# EAGLE design 0x02 (EAGLE 7.1.0)
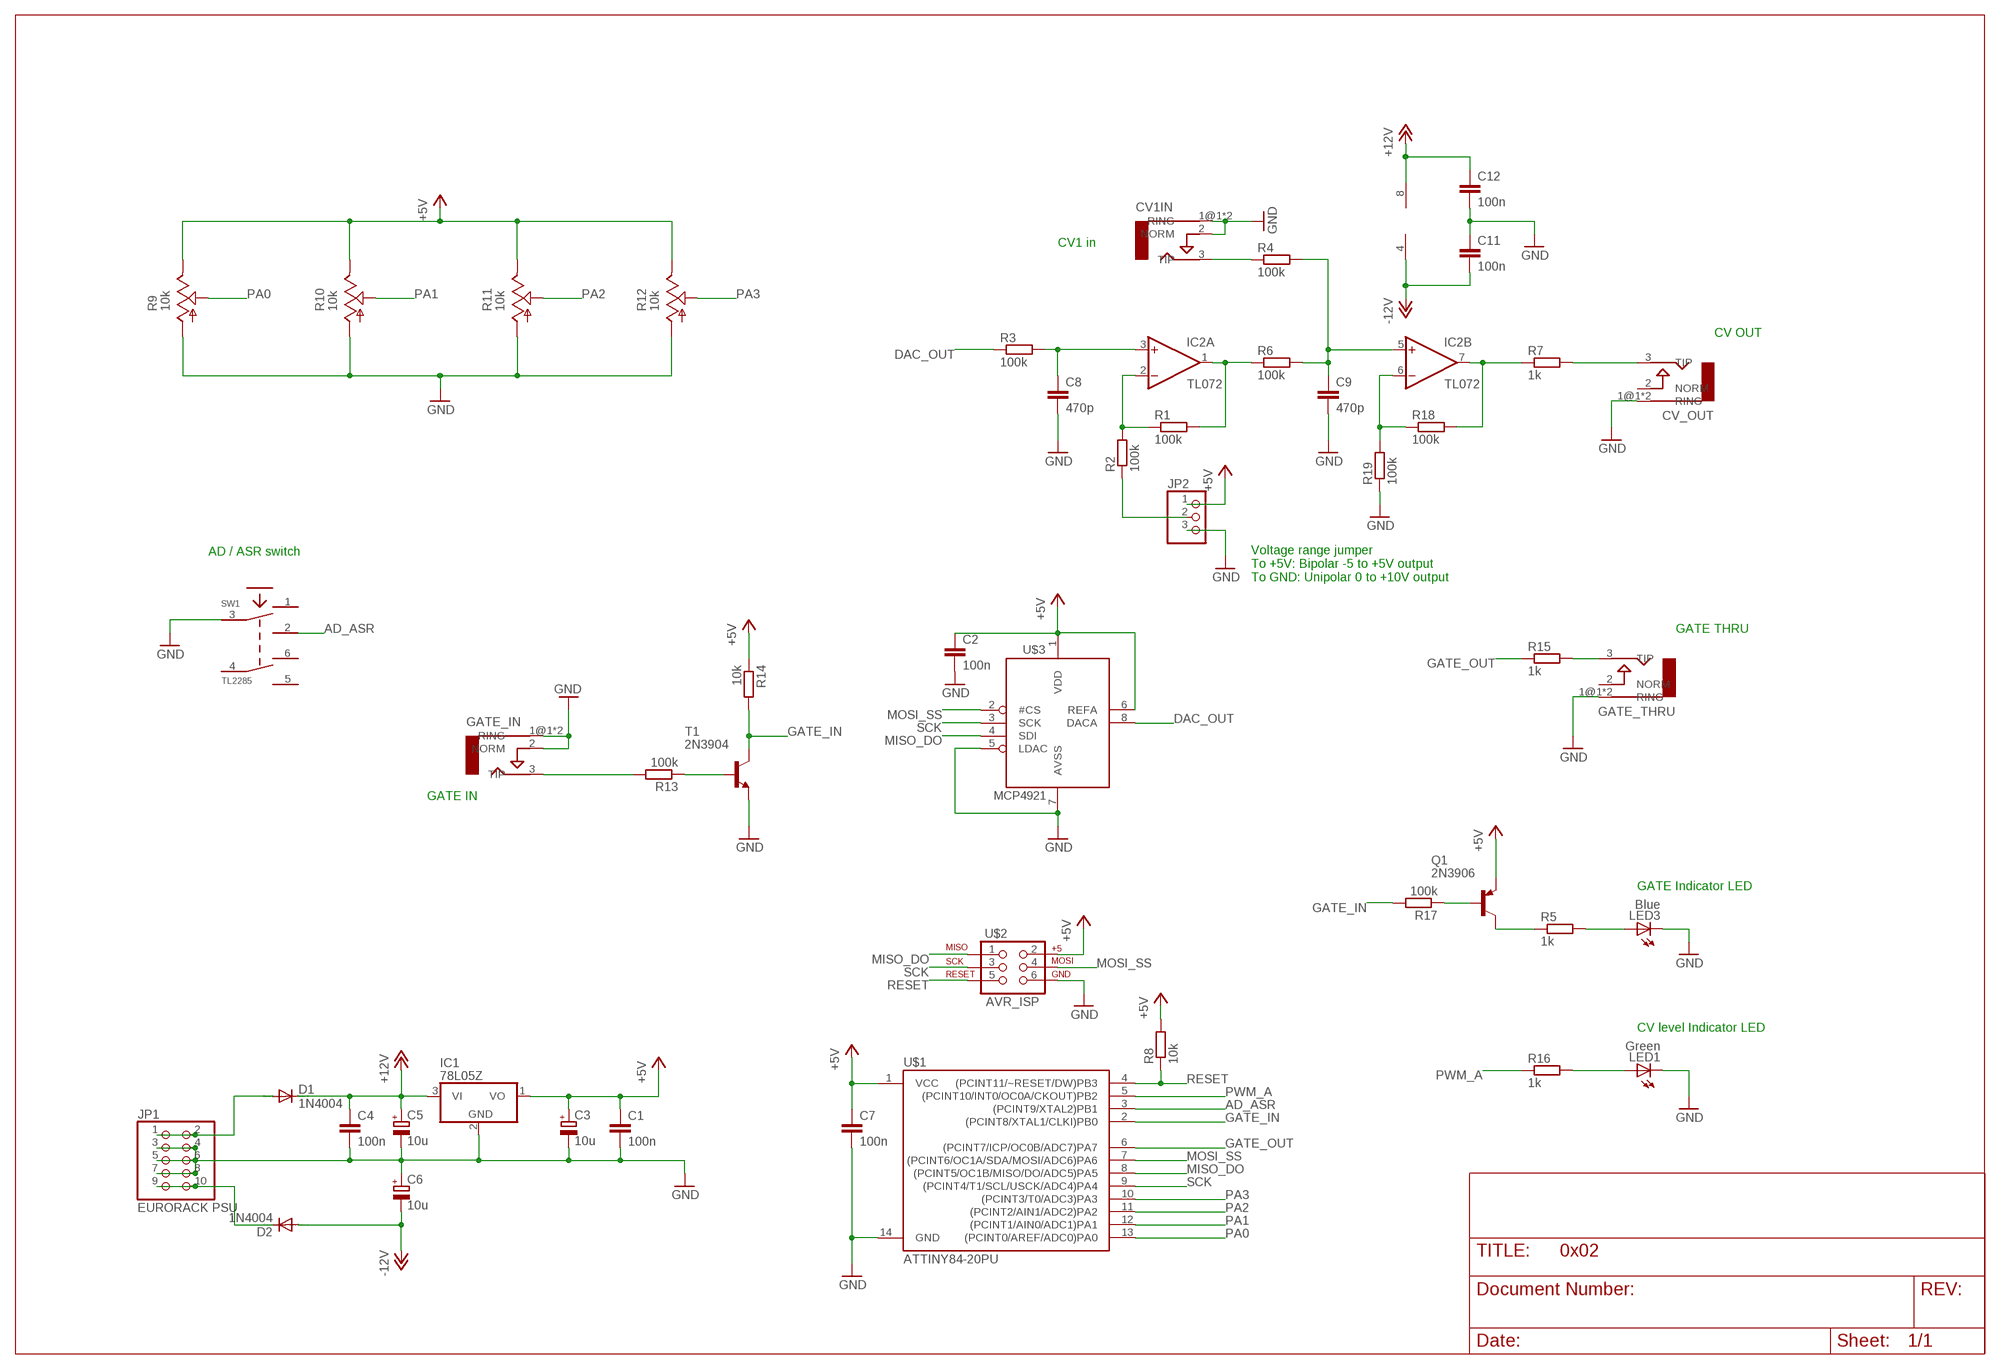
[diagram p0: schematic, sheet 1]

## Parts
C1  100n  C-EU025-025X050  [C025-025X050]
C2  100n  C-EU025-025X050  [C025-025X050]
C3  10u  CPOL-EUE2.5-5  [E2,5-5]
C4  100n  C-EU025-025X050  [C025-025X050]
C5  10u  CPOL-EUE2.5-5  [E2,5-5]
C6  10u  CPOL-EUE2.5-5  [E2,5-5]
C7  100n  C-EU025-025X050  [C025-025X050]
C8  470p  C-EU025-025X050  [C025-025X050]
C9  470p  C-EU025-025X050  [C025-025X050]
C11  100n  C-EU025-025X050  [C025-025X050]
C12  100n  C-EU025-025X050  [C025-025X050]
CV1IN  AUDIO-JACKERTHENVAR  [ERTHENVAR-JACK]
CV_OUT  CV_OUT  AUDIO-JACKERTHENVAR  [ERTHENVAR-JACK]
D1  1N4004  [DO41-10]
D2  1N4004  [DO41-10]
GATE_IN  AUDIO-JACKERTHENVAR  [ERTHENVAR-JACK]
GATE_THRU  CV_OUT  AUDIO-JACKERTHENVAR  [ERTHENVAR-JACK]
IC1  78L05Z  [TO92]
IC2  TL072  TL072P  [DIL08]
JP1  EURORACK PSU  PINHD-2X5  [2X05]
JP2  PINHD-1X3  [1X03]
LED1  Green  LED5MM  [LED5MM]
LED3  Blue  LED5MM  [LED5MM]
Q1  2N3906  [TO92]
R1  100k  R-EU_0207/2V  [0207/2V]
R2  100k  R-EU_0207/2V  [0207/2V]
R3  100k  R-EU_0207/2V  [0207/2V]
R4  100k  R-EU_0207/2V  [0207/2V]
R5  1k  R-EU_0207/2V  [0207/2V]
R6  100k  R-EU_0207/2V  [0207/2V]
R7  1k  R-EU_0207/2V  [0207/2V]
R8  10k  R-EU_0207/2V  [0207/2V]
R9  10k  POT_USVERTICAL  [ALPS_POT_VERTICAL]
R10  10k  POT_USVERTICAL  [ALPS_POT_VERTICAL]
R11  10k  POT_USVERTICAL  [ALPS_POT_VERTICAL]
R12  10k  POT_USVERTICAL  [ALPS_POT_VERTICAL]
R13  100k  R-EU_0207/2V  [0207/2V]
R14  10k  R-EU_0207/2V  [0207/2V]
R15  1k  R-EU_0207/2V  [0207/2V]
R16  1k  R-EU_0207/2V  [0207/2V]
R17  100k  R-EU_0207/2V  [0207/2V]
R18  100k  R-EU_0207/2V  [0207/2V]
R19  100k  R-EU_0207/2V  [0207/2V]
SW1  TL2285  [TL2285_PCB]
T1  2N3904  [TO92]
U$1  ATTINY84-20PU  ATTINY84ATTINY84-20PU  [DIL14]
U$2  AVR_ISP  AVR_SPI_PRG_6PTH  [2X3]
U$3  MCP4921  [DIL08]

## Nets
+5V: C1.1 C2.1 C3.+ C7.1 IC1.1(VO) JP2.1 Q1.3(E) R8.2 R9.P$1(E) R10.P$1(E) R11.P$1(E) R12.P$1(E) R14.1 U$1.1(VCC) U$2.2 U$3.1(VDD) U$3.6(REFA)
+12V: C4.1 C5.+ C12.1 D1.C IC1.3(VI) IC2.8(P:V+)
+12V_IN: D1.A JP1.1 JP1.2
-12V: C6.- C11.2 D2.A IC2.4(P:V-)
-12V_IN: D2.C JP1.9 JP1.10
AD_ASR: SW1.2 U$1.3((PCINT9/XTAL2)PB1)
DAC_OUT: R3.1 U$3.8(DACA)
GATE_IN: R14.2 R17.2 T1.1(C) U$1.2((PCINT8/XTAL1/CLKI)PB0)
GATE_OUT: R15.1 U$1.6((PCINT7/ICP/OC0B/ADC7)PA7)
GND: C1.2 C2.2 C3.- C4.2 C5.- C6.+ C7.2 C8.2 C9.2 C11.1 C12.2 CV1IN.1@1(RING) CV1IN.1@2(RING) CV1IN.2(NORM) CV_OUT.1@1(RING) CV_OUT.1@2(RING) GATE_IN.1@1(RING) GATE_IN.1@2(RING) GATE_IN.2(NORM) GATE_THRU.1@1(RING) GATE_THRU.1@2(RING) IC1.2(GND) JP1.3 JP1.4 JP1.5 JP1.6 JP1.7 JP1.8 JP2.3 LED1.K(C) LED3.K(C) R9.P$3(A) R10.P$3(A) R11.P$3(A) R12.P$3(A) R19.1 SW1.3 T1.3(E) U$1.14(GND) U$2.6 U$3.5(LDAC) U$3.7(AVSS)
MISO_DO: U$1.8((PCINT5/OC1B/MISO/DO/ADC5)PA5) U$2.1 U$3.4(SDI)
MOSI_SS: U$1.7((PCINT6/OC1A/SDA/MOSI/ADC6)PA6) U$2.4 U$3.2(#CS)
N$1: R13.1 T1.2(B)
N$2: Q1.1(C) R5.1
N$3: LED3.A R5.2
N$4: Q1.2(B) R17.1
N$5: C8.1 IC2.3(A:+IN) R3.2
N$6: JP2.2 R2.1
N$7: GATE_THRU.3(TIP) R15.2
N$8: GATE_IN.3(TIP) R13.2
N$9: IC2.2(A:-IN) R1.1 R2.2
N$10: IC2.1(A:OUT) R1.2 R6.1
N$11: CV_OUT.3(TIP) R7.2
N$12: C9.1 IC2.5(B:+IN) R4.2 R6.2
N$13: IC2.6(B:-IN) R18.1 R19.2
N$14: CV1IN.3(TIP) R4.1
N$15: IC2.7(B:OUT) R7.1 R18.2
N$19: LED1.A R16.2
PA0: R9.P$2(S) U$1.13((PCINT0/AREF/ADC0)PA0)
PA1: R10.P$2(S) U$1.12((PCINT1/AIN0/ADC1)PA1)
PA2: R11.P$2(S) U$1.11((PCINT2/AIN1/ADC2)PA2)
PA3: R12.P$2(S) U$1.10((PCINT3/T0/ADC3)PA3)
PWM_A: R16.1 U$1.5((PCINT10/INT0/OC0A/CKOUT)PB2)
RESET: R8.1 U$1.4((PCINT11/~RESET/DW)PB3) U$2.5
SCK: U$1.9((PCINT4/T1/SCL/USCK/ADC4)PA4) U$2.3 U$3.3(SCK)
Unconnected: CV_OUT.2(NORM) GATE_THRU.2(NORM) SW1.1 SW1.4 SW1.5 SW1.6

## Notes on the sheet
- CV1 in
- CV OUT
- AD / ASR switch
- Voltage range jumper
  To +5V: Bipolar -5 to +5V output
  To GND: Unipolar 0 to +10V output
- GATE THRU
- GATE IN
- GATE Indicator LED
- CV level Indicator LED

## Library data of the parts
C1 C2 C4 C7-C9 C11 C12 = rcl:C-EU: CAPACITOR, European symbol
C3 C5 C6 = rcl:CPOL-EU: POLARIZED CAPACITOR, European symbol
CV1IN CV_OUT GATE_IN GATE_THRU = erthenvar:AUDIO-JACK: Switching Mono 3.5mm Audio Jack from Erthenvar.
D1 D2 = diode:1N4004: DIODE general purpose rectifier, 1 A
IC1 = linear:78*: Positive VOLTAGE REGULATOR Source: http://cache.national.com/ds/LM/LM78L05.pdf http://www.fairchildsemi.com/ds/LM/LM7805.pdf
IC2 = og-linear:TL072: OP AMP
JP1 = pinhead:PINHD-2X5: PIN HEADER
JP2 = pinhead:PINHD-1X3: PIN HEADER
LED1 LED3 = led:LED: LED OSRAM: - CHIPLED LG R971, LG N971, LY N971, LG Q971, LY Q971, LO R971, LY R971 LH N974, LH R974 LS Q976, LO Q976, LY Q976 LO Q996 - Hyper CHIPLED LW Q18S LB Q993, LB Q99A, LB R99A - SideLED LS A670, LO A670, LY A670, LG A670, LP A670 LB A673, LV A673, LT A673, LW A673 LH A674 LY A675 LS A676, LA A676, LO A676, LY A676, LW A676 LS A679, LY A679, LG A679 - Hyper Micro SIDELED® LS Y876, LA Y876, LO Y876, LY Y876 LT Y87S - SmartLED LW L88C, LW L88S LB L89C, LB L89S, LG L890 LS L89K, LO L89K, LY L89K LS L896, LA L896, LO L896, LY L896 - TOPLED LS T670, LO T670, LY T670, LG T670, LP T670 LSG T670, LSP T670, LSY T670, LOP T670, LYG T670 LG T671, LOG T671, LSG T671 LB T673, LV T673, LT T673, LW T673 LH T674 LS T676, LA T676, LO T676, LY T676, LB T676, LH T676, LSB T676, LW T676 LB T67C, LV T67C, LT T67C, LS T67K, LO T67K, LY T67K, LW E67C LS E67B, LA E67B, LO E67B, LY E67B, LB E67C, LV E67C, LT E67C LW T67C LS T679, LY T679, LG T679 LS T770, LO T770, LY T770, LG T770, LP T770 LB T773, LV T773, LT T773, LW T773 LH T774 LS E675, LA E675, LY E675, LS T675 LS T776, LA T776, LO T776, LY T776, LB T776 LHGB T686 LT T68C, LB T68C - Hyper Mini TOPLED® LB M676 - Mini TOPLED Santana® LG M470 LS M47K, LO M47K, LY M47K Source: http://www.osram.convergy.de LUXEON: - LUMILED® LXK2-PW12-R00, LXK2-PW12-S00, LXK2-PW14-U00, LXK2-PW14-V00 LXK2-PM12-R00, LXK2-PM12-S00, LXK2-PM14-U00 LXK2-PE12-Q00, LXK2-PE12-R00, LXK2-PE12-S00, LXK2-PE14-T00, LXK2-PE14-U00 LXK2-PB12-K00, LXK2-PB12-L00, LXK2-PB12-M00, LXK2-PB14-N00, LXK2-PB14-P00, LXK2-PB14-Q00 LXK2-PR12-L00, LXK2-PR12-M00, LXK2-PR14-Q00, LXK2-PR14-R00 LXK2-PD12-Q00, LXK2-PD12-R00, LXK2-PD12-S00 LXK2-PH12-R00, LXK2-PH12-S00 LXK2-PL12-P00, LXK2-PL12-Q00, LXK2-PL12-R00 Source: www.luxeon.com KINGBRIGHT: KA-3528ASYC Source: www.kingbright.com
Q1 = transistor-pnp:2N3906: PNP Transistor
R1-R8 R13-R19 = rcl:R-EU_: RESISTOR, European symbol
R9-R12 = pot-alps:POT_US
SW1 = lb_devs:TL2285: E-Switch TL2285 (PCB switch)
T1 = transistor:2N3904: NPN TRANSISTOR
U$1 = SparkFun-DigitalIC:ATTINY84: Atmel 14-pin 2/4/8kB flash uC
U$2 = SparkFun:AVR_SPI_PRG_6: AVR ISP 6 Pin This is the reduced ISP connector for AVR programming. Common on Arduino. This footprint will take up less PCB space and can be used with a 10-pin to 6-pin adapter such as SKU: BOB-08508
U$3 = adafruit_mcp:MCP4921

## Board
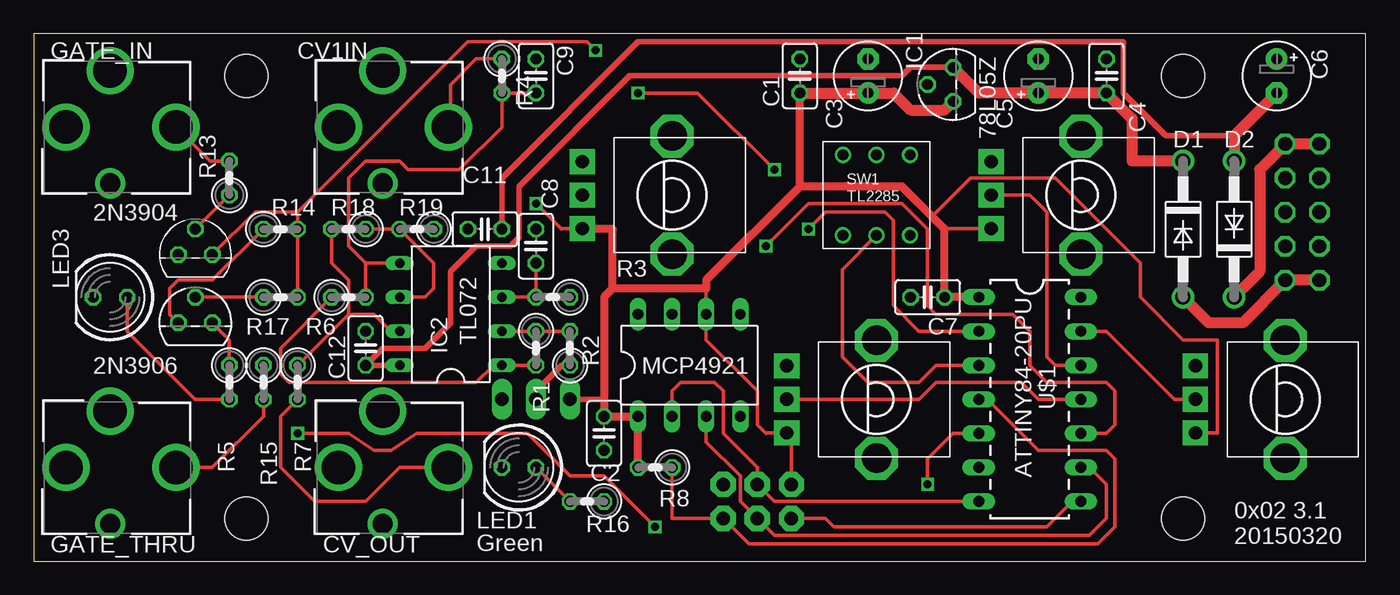
[diagram p1: board, top side]
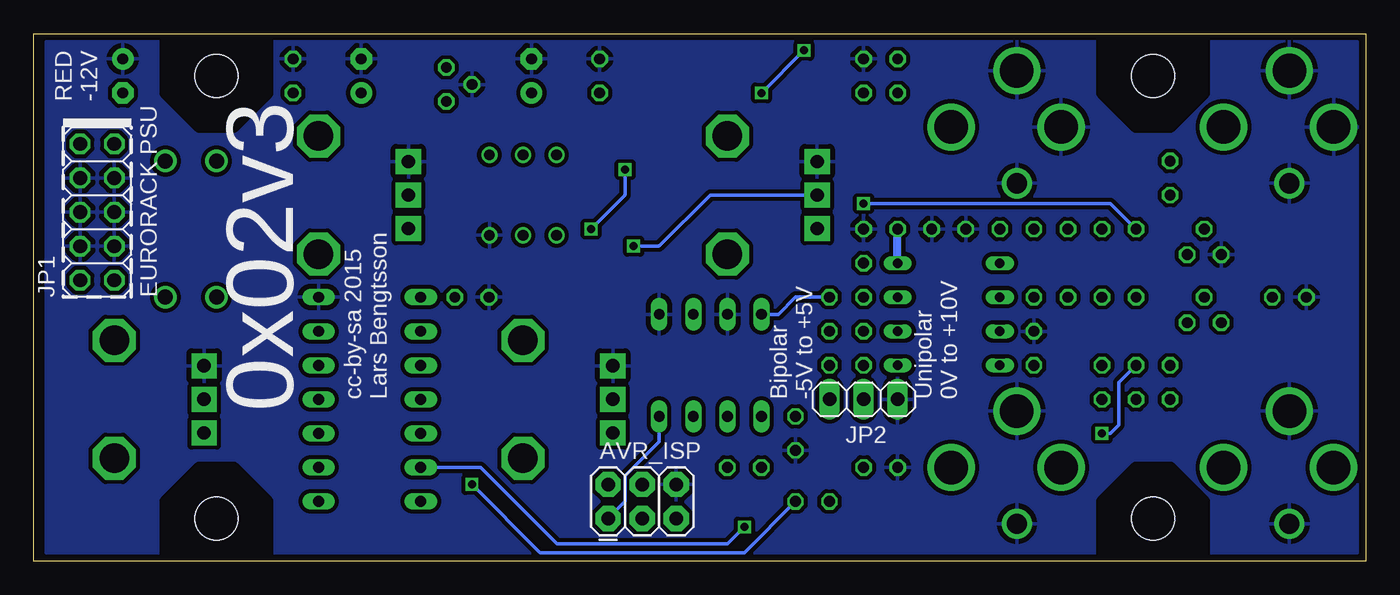
[diagram p2: board, bottom side, seen from below]

Size 99.36 x 39.36 mm. Coordinates in mm from the lower left corner, seen from the top.
Outline: 0,0 99.36,0 99.36,39.36 0,39.36 0,0
Copper layers (1*16): Top 0.0356mm / dielectric 1.5011mm / Bottom 0.0356mm
Design rules "LaenPCBOrder *": minimum track width 6mil, minimum drill 13mil, track to track 6mil, track to pad 6mil, pad to pad 6mil, via to via 6mil, smd to smd 6mil, copper to edge 15mil, drill to drill 6mil, minimum pad ring 7mil, minimum via ring 7mil, stop-mask expansion 3mil, vias tented up to drill 0mil, thermal gap 15mil
Holes 3.2 mm at 15.88,3.17 85.72,3.17 15.88,36.2 85.72,36.2
bRestrict: 24 lines

### Footprints (pad centres in the part's own frame; a part is rotated, then mirrored left to right if it is on the bottom)
C025-025X050 = drill 0.813 octagon: 1 -1.27,0; 2 1.27,0
E2,5-5 = drill 0.813 pad 1.6: + -1.27,0 | drill 0.813 pad 1.6 octagon: - 1.27,0
ERTHENVAR-JACK = drill 2.5: 1@1 -4.2,0; 2 0,-3.3; 3 0,4.9 | drill 1.5: 1@2 4.2,0
DO41-10 = drill 1.118: A 5.08,0; C -5.08,0
TO92 = drill 0.813 octagon: 1 -1.27,0; 2 0,1.905; 3 1.27,0
DIL08 = drill 0.7 long: 1 -3.81,-3.81; 2 -1.27,-3.81; 3 1.27,-3.81; 4 3.81,-3.81; 5 3.81,3.81; 6 1.27,3.81; 7 -1.27,3.81; 8 -3.81,3.81
2X05 = drill 1.016 octagon: 1 -5.08,-1.27; 2 -5.08,1.27; 3 -2.54,-1.27; 4 -2.54,1.27; 5 0,-1.27; 6 0,1.27; 7 2.54,-1.27; 8 2.54,1.27; 9 5.08,-1.27; 10 5.08,1.27
1X03 = drill 1.016 long: 1 -2.54,0; 2 0,0; 3 2.54,0
LED5MM = drill 0.813 octagon: A -1.27,0; K 1.27,0
TO92' = drill 0.813 octagon: 1 1.27,0; 2 0,1.905; 3 -1.27,0
0207/2V = drill 0.813 octagon: 1 -1.27,0; 2 1.27,0
ALPS_POT_VERTICAL = drill 1 pad 1.88 square: P$1 -2.5,6.7; P$2 0,6.7; P$3 2.5,6.7 | drill 2.2 pad 3.175 octagon: P$4 -4.4,0; P$5 4.4,0
TL2285_PCB = drill 0.8: 1 -2.5,-3; 2 0,-3; 3 2.5,-3; 4 -2.5,3; 5 0,3; 6 2.5,3
DIL14 = drill 0.813 long: 1 -8.89,-3.81; 2 -6.35,-3.81; 3 -3.81,-3.81; 4 -1.27,-3.81; 5 1.27,-3.81; 6 3.81,-3.81; 7 6.35,-3.81; 8 6.35,3.81; 9 3.81,3.81; 10 1.27,3.81; 11 -1.27,3.81; 12 -3.81,3.81; 13 -6.35,3.81; 14 -8.89,3.81
2X3 = drill 1.016 pad 1.88 octagon: 1 0,0; 2 0,2.54; 3 2.54,0; 4 2.54,2.54; 5 5.08,0; 6 5.08,2.54
DIL08' = drill 0.813 long: 1 -3.81,-3.81; 2 -1.27,-3.81; 3 1.27,-3.81; 4 3.81,-3.81; 5 3.81,3.81; 6 1.27,3.81; 7 -1.27,3.81; 8 -3.81,3.81

### Placement (x,y rotation side)
C1  57.15,36.2 90 top
C2  42.55,9.53 270 top
C3  62.23,36.2 90 top
C4  80.01,36.2 90 top
C5  74.93,36.2 90 top
C6  92.71,36.2 270 top
C7  66.67,19.68 180 top
C8  37.47,23.49 90 top
C9  37.47,36.2 90 top
C11  33.66,24.76 0 top
C12  24.76,15.88 90 top
CV1IN  26.04,32.39 270 top
CV_OUT  26.04,6.99 270 top
D1  85.72,24.76 270 top
D2  89.53,24.76 90 top
GATE_IN  5.71,32.39 270 top
GATE_THRU  5.71,6.99 270 top
IC1  68.58,35.56 90 top
IC2  31.11,18.41 90 top
JP1  94.61,26.04 90 bottom
JP2  37.47,12.06 0 bottom
LED1  36.2,6.99 180 top
LED3  5.71,19.68 180 top
Q1  2N3906  [TO92']  12.06,17.78 0 top
R1  37.47,15.88 270 top
R2  40.01,15.88 90 top
R3  38.73,19.68 180 top
R4  34.93,36.2 270 top
R5  14.61,13.34 270 top
R6  23.49,19.68 0 top
R7  19.68,13.34 270 top
R8  46.36,6.99 180 top
R9  93.34,12.06 90 top
R10  78.1,27.3 90 top
R11  62.87,12.06 90 top
R12  47.62,27.3 90 top
R13  14.61,28.57 90 top
R14  18.41,24.76 0 top
R15  17.14,13.34 270 top
R16  41.27,4.45 180 top
R17  18.41,19.68 0 top
R18  23.49,24.76 180 top
R19  28.57,24.76 180 top
SW1  62.87,27.3 0 top
T1  2N3904  [TO92']  12.06,22.86 0 top
U$1  74.3,10.79 270 top
U$2  56.52,3.17 0 bottom
U$3  MCP4921  [DIL08']  48.9,14.61 0 top

### Tracks (layer width: path | path; a pad name or v marks a point on that pad's centre or on a via)
+5V  (via drill 0.6)
  Top 0.254: R14.1 13.34,20.95 10.79,20.95 10.16,20.32 10.16,18.41 Q1.3 | R12.P$1 39.41,24.8 39.37,24.76 v37.47,26.67 | R10.P$1 67.98,24.8 67.94,24.76 | R9.P$1 88.22,9.56 88.27,9.53 88.27,16.51 85.72,16.51 82.55,19.68 82.55,22.22 76.2,28.57 69.85,28.57 66.99,25.72 | 50.16,20.32 U$3.6 50.16,16.51 53.98,12.7 53.98,10.16 54.61,9.53 54.65,9.56 R11.P$1 56.52,9.21 U$2.2
  Top 0.406: JP2.1 42.55,12.06
  Top 0.61: 57.15,27.94 64.77,27.94 66.99,25.72 67.94,24.76 C7.1 U$1.1 | 57.15,27.94 50.16,20.95 50.16,20.32 43.18,20.32 | 43.18,20.32 42.55,19.68 42.55,12.06 C2.1 U$3.1 R8.2 | 43.18,20.32 43.18,24.76 40.97,24.76 R12.P$1 | 57.15,27.94 C1.1
  Top 0.813: C1.1 C3.+ 64.13,34.93 65.41,33.66 67.94,33.66 IC1.1
  Bottom 0.254: v37.47,26.67 19.05,26.67 R14.1
+12V
  Top 0.406: IC1.3 65.41,36.83 64.77,36.2 44.45,36.2 36.2,27.94 36.2,24.13 35.56,23.49 33.02,23.49 31.11,21.59 31.11,17.78 29.21,15.88 26.04,15.88 C12.1 IC2.8
  Top 0.813: D1.C 81.91,29.84 81.91,33.02 C4.1 C5.+ 70.48,34.93 IC1.3
+12V_IN
  Top 0.813: JP1.2 JP1.1 90.17,17.78 87.63,17.78 D1.A
-12V
  Top 0.406: 89.53,31.75 84.45,31.75 81.28,34.93 81.28,38.73 45.09,38.73 34.93,28.57 C11.2
  Top 0.813: C6.- 89.53,31.75 D2.A
  Bottom 0.61: IC2.4 C11.2
-12V_IN
  Top 0.813: JP1.10 JP1.9 91.44,29.21 91.44,21.59 D2.C
AD_ASR
  Top 0.254: U$1.3 67.31,14.61 66.04,13.34 62.23,13.34 60.33,15.24 60.33,21.76 SW1.2
DAC_OUT
  Bottom 0.254: R3.1 42.55,19.68 43.82,18.41 U$3.8
GATE_IN  (via drill 0.6)
  Top 0.254: T1.1 16.51,26.04 19.68,26.04 | R17.2 R14.2 19.68,26.04 | 19.68,26.04 32.39,38.73 41.27,38.73 v41.91,38.1 | v45.09,34.93 49.53,34.93 v55.25,29.21 | v57.79,24.76 59.05,26.04 63.5,26.04 64.13,25.4 64.13,19.05 66.04,17.14 U$1.2
  Bottom 0.254: v41.91,38.1 v45.09,34.93 | v55.25,29.21 55.25,27.3 v57.79,24.76
GATE_OUT  (via drill 0.6)
  Top 0.254: v46.36,2.54 42.55,6.35 40.01,6.35 36.83,9.53 28.57,9.53 26.67,8.26 25.4,8.26 23.49,9.53 v19.68,9.53
  Bottom 0.254: U$1.6 66.04,6.99 60.33,1.27 47.62,1.27 v46.36,2.54 | v19.68,9.53 19.05,9.53 18.41,10.16 18.41,13.34 R15.1
GND
  pour Bottom (isolate 0.305): 0.64,38.73 0.64,0.64 98.42,0.64 98.42,38.73
MISO_DO
  Top 0.254: U$1.8 77.47,4.45 75.56,2.54 59.69,2.54 59.05,3.17 U$2.1
  Bottom 0.254: U$3.4 52.71,8.89 55.25,6.35 55.25,4.45 U$2.1
MOSI_SS
  Top 0.254: U$1.7 55.25,4.45 U$2.4 53.98,6.99 51.44,9.53 51.44,12.7 50.8,13.34 48.26,13.34 47.62,12.7 U$3.2
N$1
  Top 0.254: R13.1 T1.2
N$2
  Top 0.254: R5.1 14.61,16.51 Q1.1
N$3
  Top 0.254: R5.2 12.06,12.06 6.99,17.14 LED3.A
N$4
  Top 0.254: Q1.2 R17.1
N$5
  Top 0.254: IC2.3 R3.2 C8.1
N$6
  Top 0.406: R2.1 39.37,14.61 37.47,12.7 JP2.2
N$7
  Top 0.254: R15.2 17.14,10.79 13.34,6.99 GATE_THRU.3
N$8
  Top 0.254: R13.2 13.15,29.84 GATE_IN.3
N$9
  Top 0.254: IC2.2 R1.1 R2.2
N$10
  Top 0.254: R6.1 18.41,15.88 18.41,13.97 19.05,13.34 33.02,13.34 34.29,14.61 IC2.1 R1.2
N$11
  Top 0.254: R7.2 18.41,10.79 18.41,6.99 20.95,4.45 24.76,4.45 27.3,6.99 CV_OUT.3
N$12
  Top 0.254: C9.1 R4.2 34.93,32.39 31.75,29.21 27.94,29.21 27.3,29.84 24.76,29.84 23.49,28.57 23.49,23.49 24.76,22.22 | IC2.5 24.76,22.22 | 24.76,22.22 R6.2
N$13
  Top 0.254: R18.1 R19.2 29.84,22.22 29.84,20.32 29.21,19.68 IC2.6
N$14
  Top 0.254: R4.1 33.02,37.47 31.11,35.56 31.11,32.57 CV1IN.3
N$15
  Top 0.254: IC2.7 26.67,17.14 25.4,18.41 23.49,18.41 | 23.49,18.41 R7.1 | R18.2 22.22,22.22 23.49,20.95 23.49,18.41
N$19
  Top 0.254: LED1.A R16.2
PA0
  Top 0.254: R9.P$2 85.09,12.06 80.01,17.14 U$1.13
PA1
  Top 0.254: R10.P$2 74.3,27.3 75.56,26.04 75.56,15.24 76.2,14.61 U$1.12
PA2
  Top 0.254: U$1.11 74.93,12.06 73.66,13.34 67.31,13.34 66.04,12.06 R11.P$2
PA3  (via drill 0.6)
  Top 0.254: U$1.10 80.01,9.53 80.64,10.16 80.64,12.7 80.01,13.34 75.56,13.34 74.3,14.61 74.3,17.14 73.02,18.41 67.31,18.41 66.67,19.05 66.67,24.76 64.77,26.67 57.79,26.67 v54.61,23.49
  Bottom 0.254: v54.61,23.49 52.71,23.49 48.9,27.3 R12.P$2
PWM_A  (via drill 0.6)
  Top 0.254: v66.67,5.71 66.67,7.62 68.58,9.53 U$1.5
  Bottom 0.254: v66.67,5.71 61.59,0.64 46.36,0.64 R16.1
RESET
  Top 0.254: R8.1 47.62,3.17 U$2.5 53.34,1.27 79.38,1.27 80.64,2.54 80.64,7.62 80.01,8.26 74.93,8.26 71.12,12.06 U$1.4
SCK
  Top 0.254: U$1.9 78.74,6.99 80.01,5.71 80.01,3.17 78.74,1.91 55.25,1.91 U$2.3 52.71,4.45 52.71,6.35 50.16,8.89 U$3.3

### Text on the board
bPlace: RED / -12V | 0x02v3 | Unipolar / 0V to +10V | Bipolar / -5V to +5V | cc-by-sa 2015 / Lars Bengtsson
tNames: 0x02 3.1 / 20150320